# Altium schematic sheet analog_in.SchDoc
size A3; DocumentNumber: 5; SheetNumber: 5; SheetTotal: 11; AUTHOR: Fraunhofer IISB foxBMS Team; SheetDescription: I2C analog multiplexer for temperature inputs
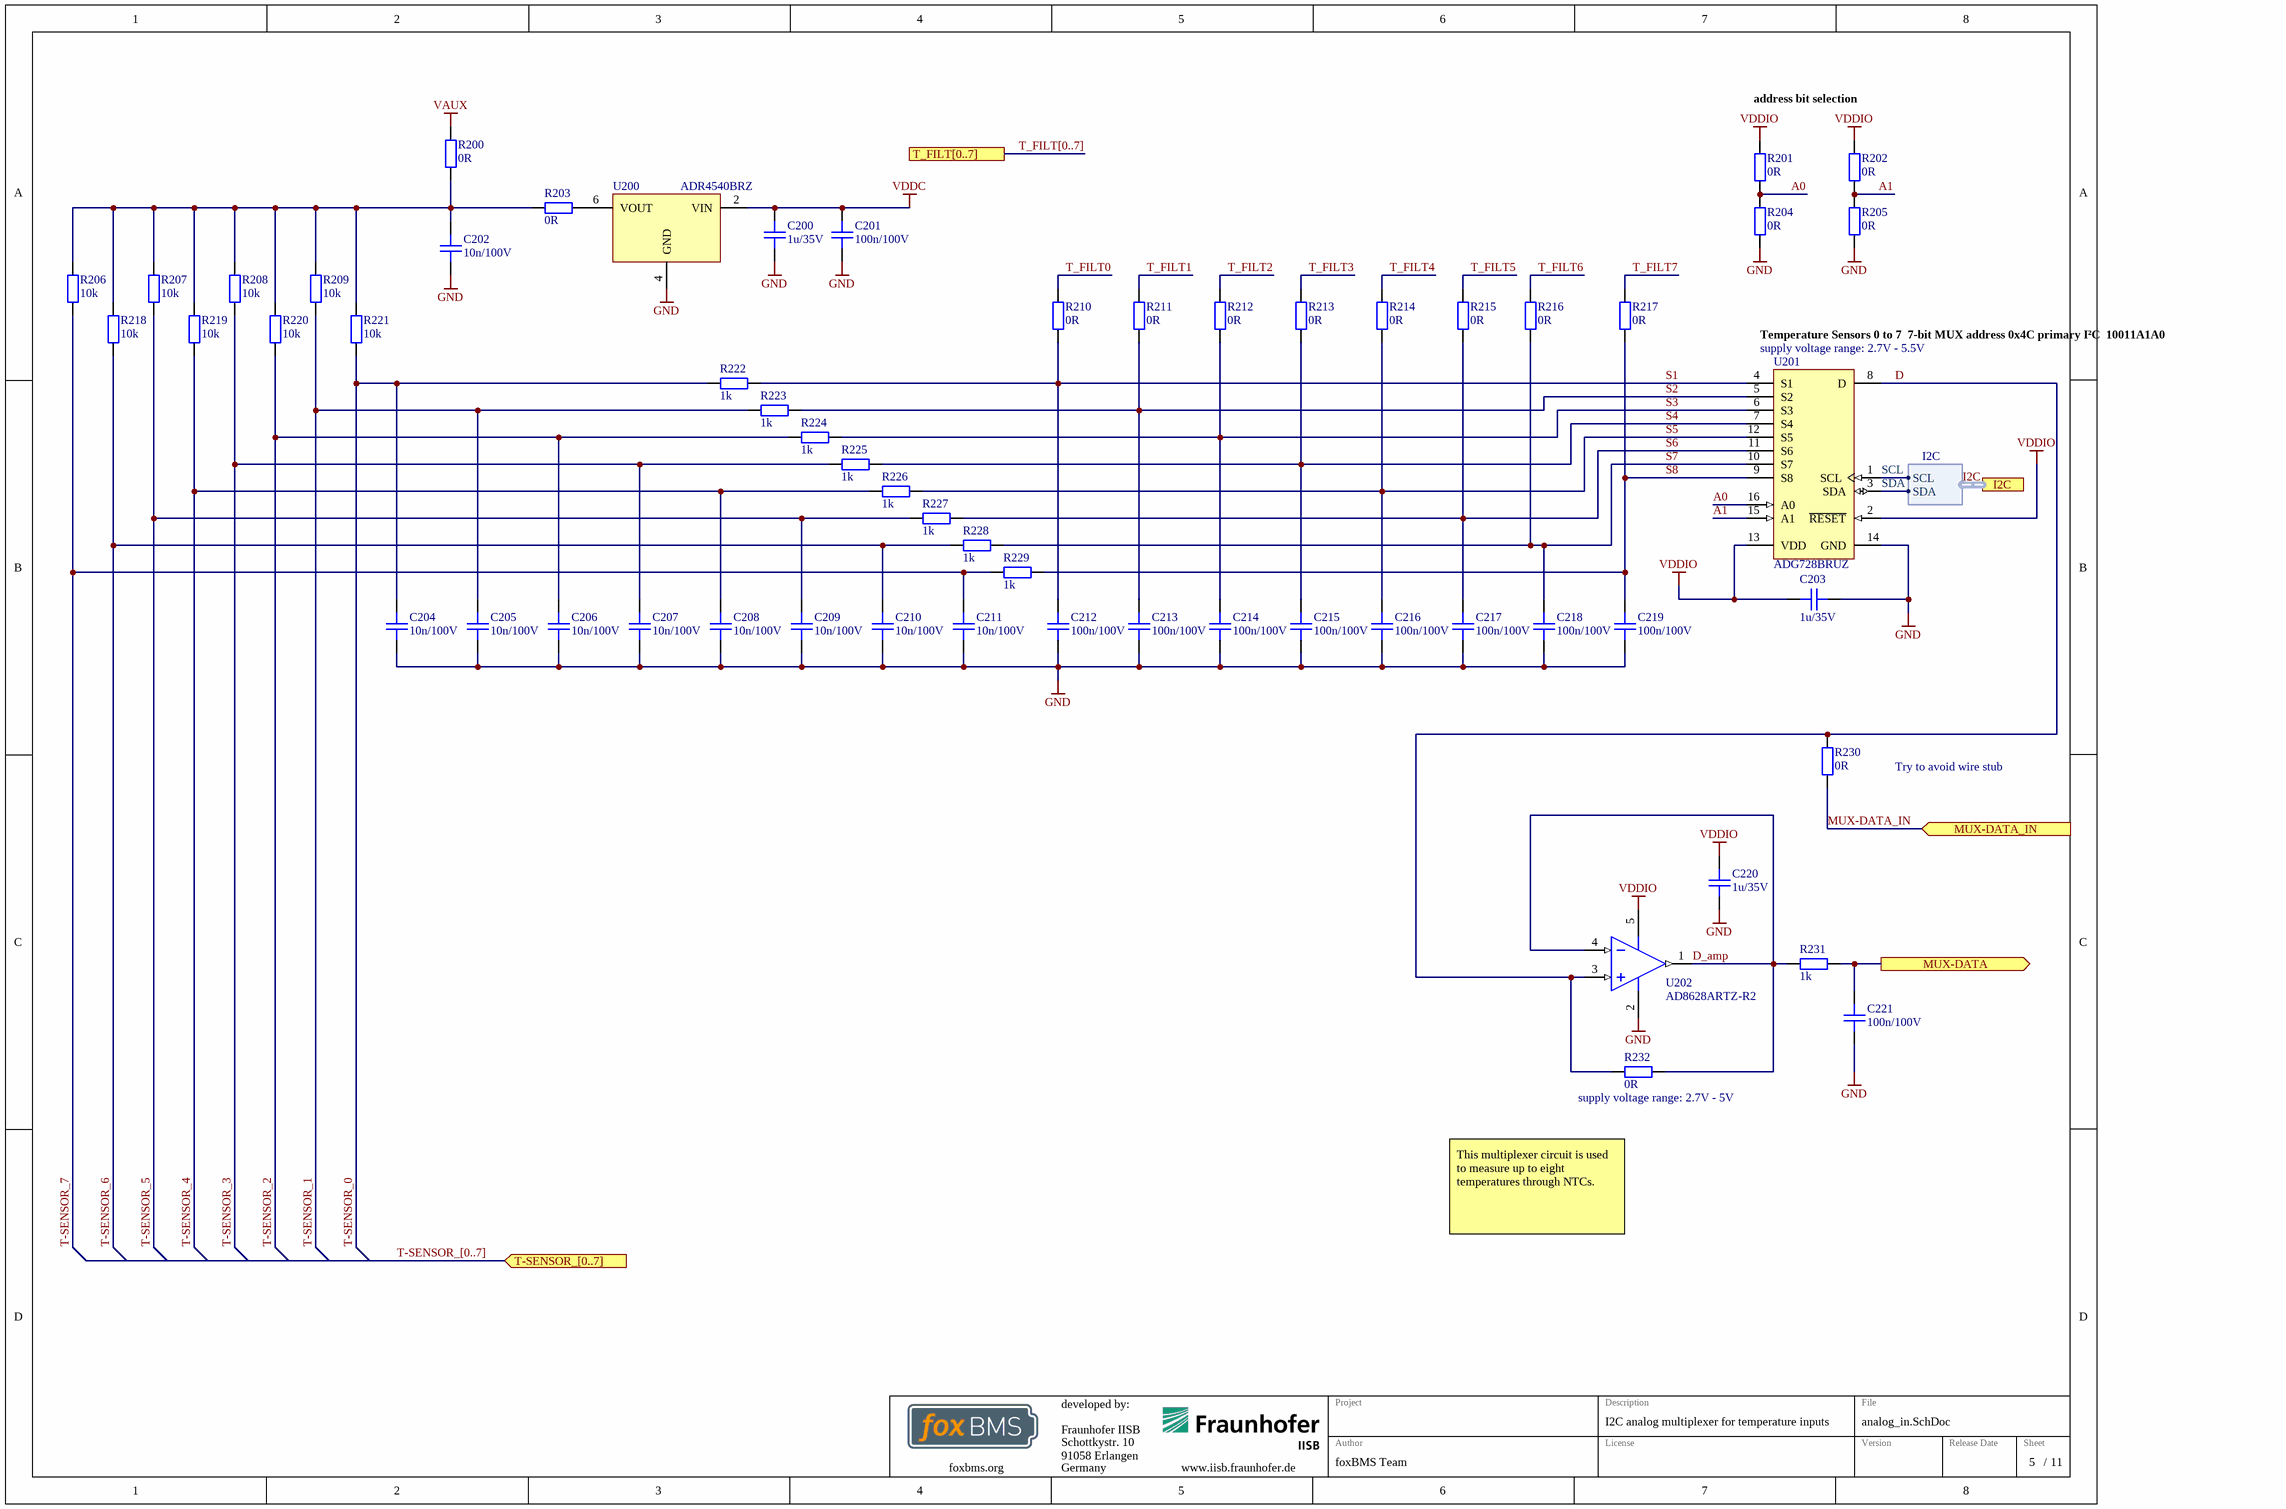
[diagram p0: analog_in.SchDoc]

## Parts
C200  1u/35V  [CAPC1608X08N]
C201  100n/100V  [CAPC1608X08N]
C202  10n/100V  [CAPC1608X08N]
C203  1u/35V  [CAPC1608X08N]
C204  10n/100V  [CAPC1608X08N]
C205  10n/100V  [CAPC1608X08N]
C206  10n/100V  [CAPC1608X08N]
C207  10n/100V  [CAPC1608X08N]
C208  10n/100V  [CAPC1608X08N]
C209  10n/100V  [CAPC1608X08N]
C210  10n/100V  [CAPC1608X08N]
C211  10n/100V  [CAPC1608X08N]
C212  100n/100V  [CAPC1608X08N]
C213  100n/100V  [CAPC1608X08N]
C214  100n/100V  [CAPC1608X08N]
C215  100n/100V  [CAPC1608X08N]
C216  100n/100V  [CAPC1608X08N]
C217  100n/100V  [CAPC1608X08N]
C218  100n/100V  [CAPC1608X08N]
C219  100n/100V  [CAPC1608X08N]
C220  1u/35V  [CAPC1608X08N]
C221  100n/100V  [CAPC1608X08N]
R200  0R  [RESC1608X05N]
R201  0R  [RESC1608X05N]
R202  0R  [RESC1608X05N]
R203  0R  [RESC1608X05N]
R204  0R  [RESC1608X05N]
R205  0R  [RESC1608X05N]
R206  10k  [RESC1608X05N]
R207  10k  [RESC1608X05N]
R208  10k  [RESC1608X05N]
R209  10k  [RESC1608X05N]
R210  0R  [RESC1608X05N]
R211  0R  [RESC1608X05N]
R212  0R  [RESC1608X05N]
R213  0R  [RESC1608X05N]
R214  0R  [RESC1608X05N]
R215  0R  [RESC1608X05N]
R216  0R  [RESC1608X05N]
R217  0R  [RESC1608X05N]
R218  10k  [RESC1608X05N]
R219  10k  [RESC1608X05N]
R220  10k  [RESC1608X05N]
R221  10k  [RESC1608X05N]
R222  1k  [RESC1608X05N]
R223  1k  [RESC1608X05N]
R224  1k  [RESC1608X05N]
R225  1k  [RESC1608X05N]
R226  1k  [RESC1608X05N]
R227  1k  [RESC1608X05N]
R228  1k  [RESC1608X05N]
R229  1k  [RESC1608X05N]
R230  0R  [RESC1608X05N]
R231  1k  [RESC1608X05N]
R232  0R  [RESC1608X05N]
U200  ADR4540BRZ  [SOIC127P600X175-8N]
U201  ADG728BRUZ  [ADI-RU-16_M]
U202  AD8628ARTZ-R2  [ADI-RJ-5_M]

## Ports
I2C (harness I2C), MUX-DATA (out), MUX-DATA_IN (in), T-SENSOR_[0..7] (in), T_FILT[0..7]

## Harnesses
I2C: SCL, SDA

## Nets
GND: C200.1 C201.1 C202.1 C203.1 C204.1 C205.1 C206.1 C207.1 C208.1 C209.1 C210.1 C211.1 C212.1 C213.1 C214.1 C215.1 C216.1 C217.1 C218.1 C219.1 C220.1 C221.1 R204.1 R205.1 U200.4(GND) U201.14(GND) U202.2(-V)
VAUX: R200.2
VDDC: C200.2 C201.2 U200.2(VIN)
VDDIO: C203.2 C220.2 R201.2 R202.2 U201.2(~{RESET}) U201.13(VDD) U202.5(+V)
A0: R201.1 R204.2 U201.16(A0)
A1: R202.1 R205.2 U201.15(A1)
D: R230.1 R232.1 U201.8(D) U202.3(+IN)
D_amp: R231.1 R232.2 U202.1(OUT) U202.4(-IN)
MUX-DATA: C221.2 R231.2 ; port MUX-DATA
MUX-DATA_IN: R230.2 ; port MUX-DATA_IN
S1: C212.2 R210.1 R222.1 U201.4(S1)
S2: C213.2 R211.1 R223.1 U201.5(S2)
S3: C214.2 R212.1 R224.1 U201.6(S3)
S4: C215.2 R213.1 R225.1 U201.7(S4)
S5: C216.2 R214.1 R226.1 U201.12(S5)
S6: C217.2 R215.1 R227.1 U201.11(S6)
S7: C218.2 R216.1 R228.1 U201.10(S7)
S8: C219.2 R217.1 R229.1 U201.9(S8)
SCL: U201.1(SCL) ; port I2C.SCL  [project net I2C.SCL]
SDA: U201.3(SDA) ; port I2C.SDA  [project net I2C.SDA]
T-SENSOR_0: C204.2 R221.1 R222.2
T-SENSOR_1: C205.2 R209.1 R223.2
T-SENSOR_2: C206.2 R220.1 R224.2
T-SENSOR_3: C207.2 R208.1 R225.2
T-SENSOR_4: C208.2 R219.1 R226.2
T-SENSOR_5: C209.2 R207.1 R227.2
T-SENSOR_6: C210.2 R218.1 R228.2
T-SENSOR_7: C211.2 R206.1 R229.2
T_FILT0: R210.2
T_FILT1: R211.2
T_FILT2: R212.2
T_FILT3: R213.2
T_FILT4: R214.2
T_FILT5: R215.2
T_FILT6: R216.2
T_FILT7: R217.2
NetC202_2: C202.2 R200.1 R203.1 R206.2 R207.2 R208.2 R209.2 R218.2 R219.2 R220.2 R221.2
NetR203_2: R203.2 U200.6(VOUT)

## Buses and harness runs
bus T-SENSOR_[0..7] = port T-SENSOR_[0..7]
bus T_FILT[0..7] = port T_FILT[0..7]
harness I2C = port I2C

## Notes on the sheet
- address bit selection
- (near U201) Temperature Sensors 0 to 7
  7-bit MUX address 0x4C primary I²C
  10011A1A0
- (near U201) supply voltage range: 2.7V - 5.5V
- Try to avoid wire stub
- (near R232) supply voltage range: 2.7V - 5V
- This multiplexer circuit is used to measure up to eight temperatures through NTCs.
- Fraunhofer IISB
- Schottkystr. 10
- developed by:
- 91058 Erlangen
- Germany
- Author
- Project
- License
- Description
- File
- Version
- Release Date
- Sheet
- foxbms.org <https://foxbms.org>
- www.iisb.fraunhofer.de <https://www.iisb.fraunhofer.de/>
- foxBMS Team
- /

## Library data of the parts
C200 = gen_C_ceramic_1u_35V_X7R_0603: MLCC; Capacitance: 1u; Rated Voltage: 35V; Dielectric: X7R; Case EIA: 0603; Case Metric: 1608; PnP Package: 0603C; PnP Value: 1uF/35V/X7R; PnP equipped: x; Automotive Qualified: True; AEC-Q Norm: AEC-Q200; Part Number: gen_C_ceramic_1u_35V_X7R_0603; Operating Temperature: -55°C - +125°C; Supplier 1: Farnell; Supplier Part Number 1: 2906941; ECCN: EAR99
C201 C212-C219 C221 = gen_C_ceramic_100n_100V_X7R_0603: MLCC; Capacitance: 100n; Rated Voltage: 100V; Dielectric: X7R; Case EIA: 0603; Case Metric: 1608; Automotive Qualified: True; PnP Package: 0603C; Part Number: gen_C_ceramic_100n_100V_X7R_0603; Supplier 1: Digikey; Supplier Part Number 1: 490-13420-1-ND; Supplier 2: Mouser; Supplier Part Number 2: 81-GCJ188R72A104KA1D
C202 = gen_C_ceramic_10n_100V_X7R_0603: MLCC; Capacitance: 10n; Rated Voltage: 100V; Dielectric: X7R; Case EIA: 0603; Case Metric: 1608; Automotive Qualified: True; PnP Package: 0603C; PnP Value: 10nF/100V/X7R; AEC-Q Norm: AEC-Q200; Part Number: gen_C_ceramic_10n_100V_X7R_0603; Supplier 1: Farnell; Supplier Part Number 1: 1301715; Supplier 2: Farnell; Supplier Part Number 2: 2821192; Supplier 3: Farnell; Supplier Part Number 3: 2210878; ECCN: EAR99
C203 C220 = gen_C_ceramic_1u_35V_X7R_0603: MLCC; Capacitance: 1u; Rated Voltage: 35V; Dielectric: X7R; Case EIA: 0603; Case Metric: 1608; Automotive Qualified: True; PnP Package: 0603C; PnP Value: 1uF/35V/X7R; PnP equipped: x; AEC-Q Norm: AEC-Q200; Part Number: gen_C_ceramic_1u_35V_X7R_0603; Supplier 1: Farnell; Supplier Part Number 1: 2906941; Operating Temperature: -55°C - +125°C; ECCN: EAR99
C204-C211 = gen_C_ceramic_10n_100V_X7R_0603: MLCC; Capacitance: 10n; Rated Voltage: 100V; Dielectric: X7R; Case EIA: 0603; Case Metric: 1608; PnP Package: 0603C; PnP Value: 10nF/100V/X7R; Automotive Qualified: True; AEC-Q Norm: AEC-Q200; Part Number: gen_C_ceramic_10n_100V_X7R_0603; Supplier 1: Farnell; Supplier Part Number 1: 1301715; Supplier 2: Farnell; Supplier Part Number 2: 2821192; Supplier 3: Farnell; Supplier Part Number 3: 2210878; ECCN: EAR99
R200-R205 R210-R217 R230 R232 = gen_R_0R_0603: SMD Resistor 0R 0603; Power: 0.1W; Case EIA: 0603; Case Metric: 1608; Maximum Working Voltage: 75V; PnP Package: 0603R; Automotive Qualified: True; PnP equipped: x; Part Number: gen_R_0R_0603; Operating Temperature: -55°C - +155°C; Resistance: 0R; Series: Jumper; PnP Value: 0R; Supplier 1: Farnell; Supplier Part Number 1: 2616580
R206-R209 R218-R221 = gen_R_10k_0603: SMD Resistor 10k 0603; Tolerance: 1%; Power: 0.1W; Case EIA: 0603; Case Metric: 1608; Maximum Working Voltage: 75V; PnP Package: 0603R; Automotive Qualified: True; Part Number: gen_R_10k_0603; Operating Temperature: -55°C - +155°C; Resistance: 10k; Series: E24, E96; PnP Value: 10k; Supplier 1: Farnell; Supplier Part Number 1: 2073349
R222-R229 R231 = gen_R_1k_0603: SMD Resistor 1k 0603; Tolerance: 1%; Power: 0.1W; Case EIA: 0603; Case Metric: 1608; Maximum Working Voltage: 75V; PnP Package: 0603R; Automotive Qualified: True; PnP equipped: x; Part Number: gen_R_1k_0603; Operating Temperature: -55°C - +155°C; Resistance: 1k; Series: E24, E96; PnP Value: 1k; Supplier 1: Farnell; Supplier Part Number 1: 1652848
U200 = ADR4540BRZ: Ultralow Noise, High Accuracy 4.096V Reference; Manufacturer: Analog Devices; PnP Package: SO-8; Automotive Qualified: True; AEC-Q Norm: AEC-Q100; AEC-Q Grade: unknown; Part Number: ADR4540BRZ; Part Name: ADR4540BRZ; Operating Temperature: −40°C - +125°C; ComponentLink1Description: Datasheet; ComponentLink1URL: http://www.analog.com/media/en/technical-documentation/data-sheets/ADR4520_4525_4530_4533_4540_4550.pdf; Supplier 1: Farnell; Supplier Part Number 1: 2112692; Supplier 2: Mouser; Supplier Part Number 2: 584-ADR4540BRZ; Supplier 3: Digikey; Supplier Part Number 3: ADR4540BRZ-ND; ECCN: EAR99
U201 = CMP-0798-00197-1: CMOS, Low Voltage, 2-Wire Serially Controlled, Matrix Switch, -40 to 85 degC, 16-pin SOP (RU-16), Tube; Manufacturer: Analog Devices; Ron (ohms): 2.5; Supply V Guar Performance: Single_(+3V), Single_(+5V); Max Analog Signal Range: 0 to Vdd; Bandwidth (Hz): 65M; ComponentLink3Description: Package Specification; Packing: Tube; PartNumber: ADG728BRUZ; ComponentLink1URL: http://www.analog.com/en/index.html; Mounting Technology: Surface Mount; DatasheetVersion: Rev. C; ComponentLink1Description: Manufacturer URL; ComponentLink3URL: http:/www.analog.com/static/imported-files/packages/36244347913743854010197452789RU16.pdf; ComponentLink2URL: http://www.analog.com/static/imported-files/data_sheets/ADG728_729.pdf; PackageVersion: Nov-02; PackageDescription: 16-Pin Thin Shrink Small Outline Package, Body 5 x 4.4 mm, Pitch 0.65 mm; Code_JEDEC: MO-153AB; PackageReference: RU-16; ComponentLink2Description: Datasheet
U202 = CMP-0384-01512-2: Single Channel RRIO Operational Amplifier, 2.5 MHz BW, 1 V/us SR, Industrial, 5-pin SOT23 (RJ-5), Reel; Manufacturer: Analog Devices; Generic Part Number: AD8628; Iq/Amp: 1.1mA; Automotive Qualified: Yes; V Span Max: 6V; Input Bias Current: 30pA; Slew Rate: 1V/us; Amplifiers Per Package: 1; Input Offset Voltage: 1uV; Small Signal Bandwidth: 2.5MHz; V Span Min: 2.7V; ComponentLink1Description: Manufacturer URL; DatasheetVersion: Rev. I; ComponentLink4Description: Reference Circuit; Code_JEDEC: MO-178-AA; PackageDescription: 5-Pin Small Outline Transistor Package, Body 2.9 x 1.6 mm, Pitch 0.95 mm; ComponentLink3URL: http://www.analog.com/static/imported-files/packages/PKG_PDF/SOT-23(RJ)/RJ_5.pdf; PackageReference: RJ-5; ComponentLink1URL: http://www.analog.com/en/index.html; PackageVersion: 121608-A; RevisionNote: Reference Circuit URL fixed; Mounting Technology: Surface Mount; ComponentLink2Description: Datasheet; ComponentLink3Description: Package Specification; ComponentLink4URL: http://www.analog.com/en/all-operational-amplifiers-op-amps/operational-amplifiers-op-amps/ad8628/products/product.html#product-recommendations; ComponentLink2URL: http://www.analog.com/static/imported-files/data_sheets/AD8628_8629_8630.pdf; PartNumber: AD8628ARTZ-R2